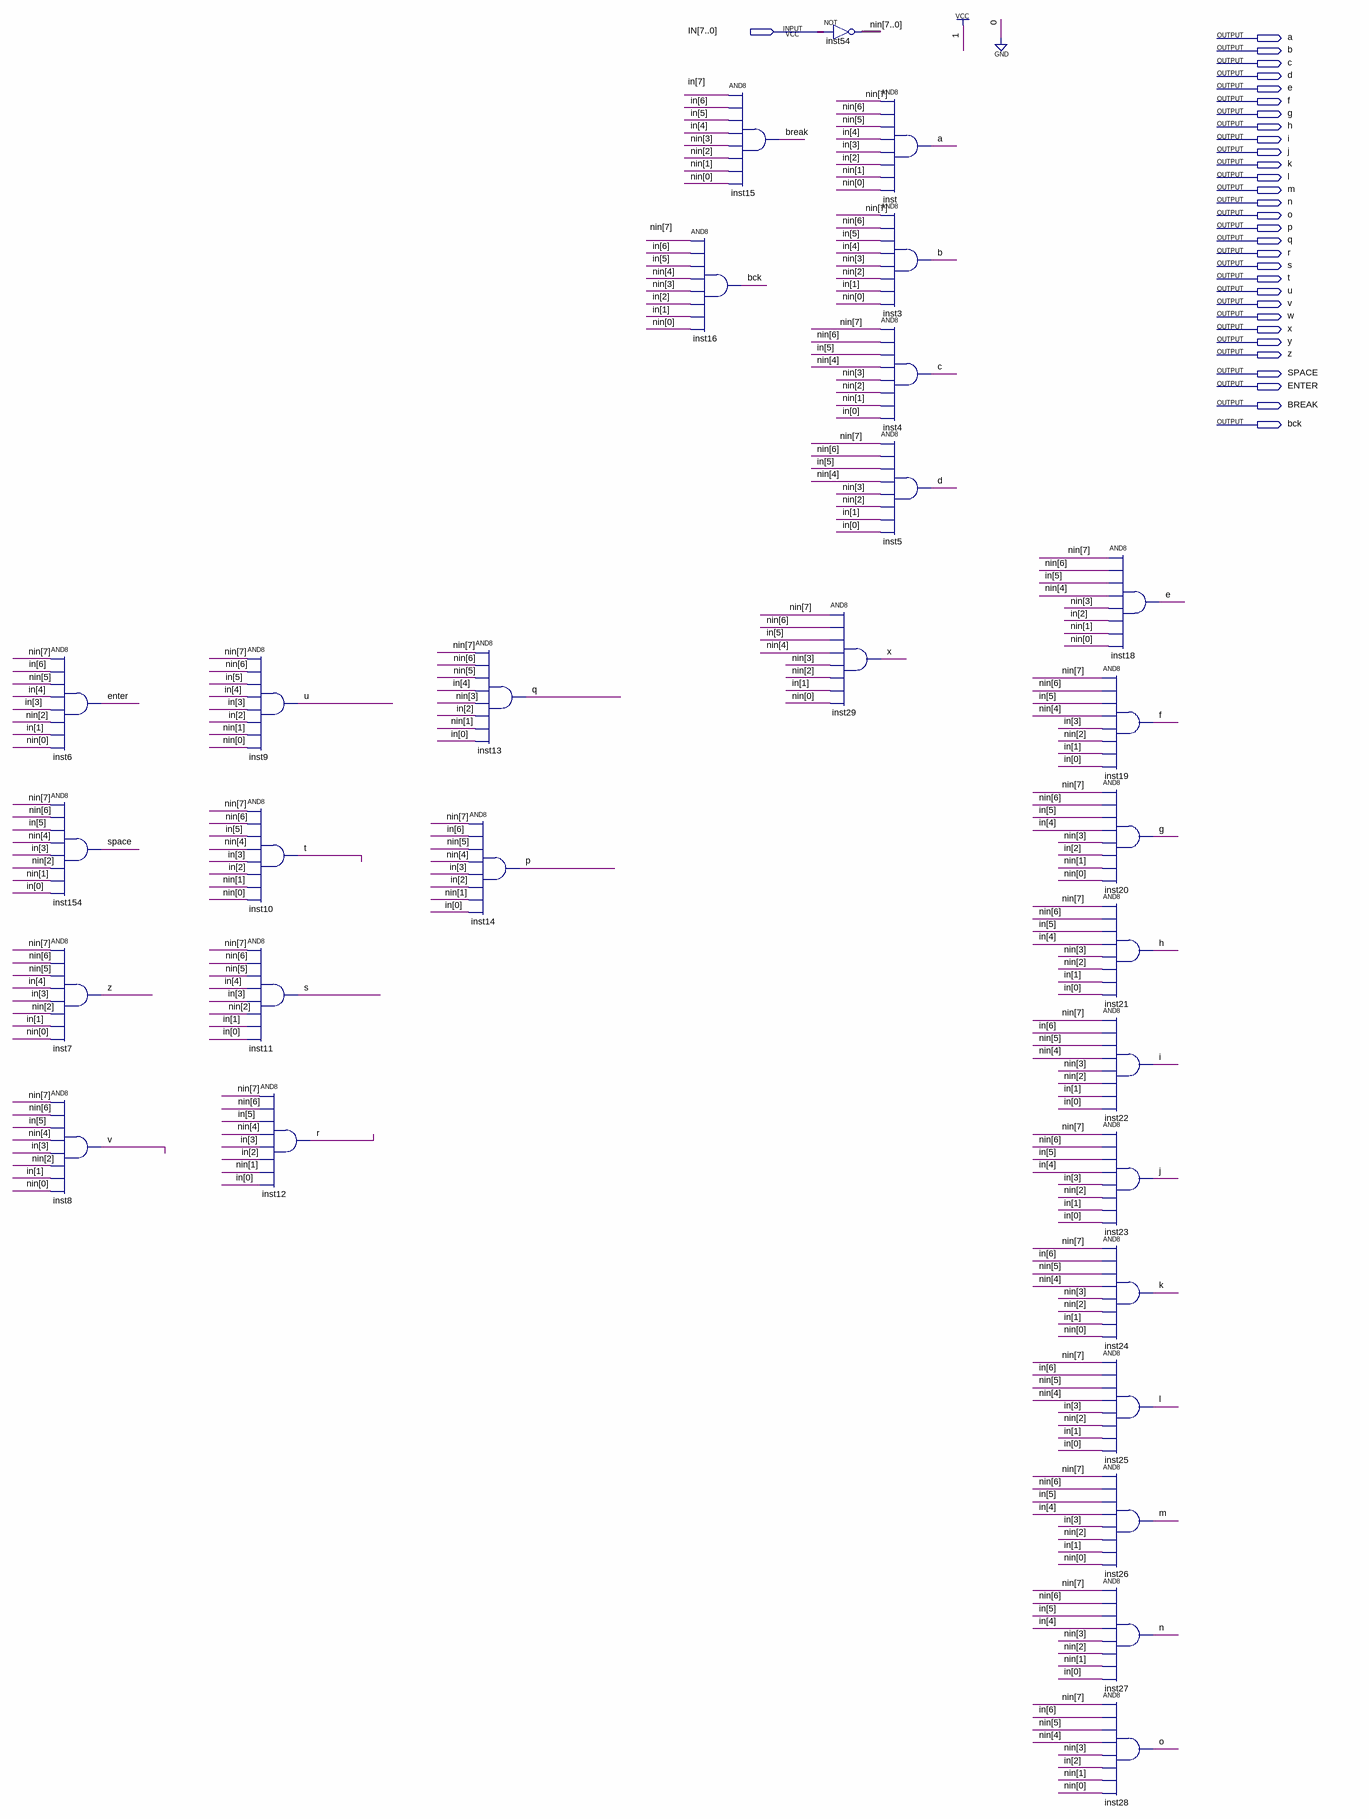
[diagram p0: schematic sheet]
// Quartus schematic Kodovi.bdf as structural Verilog: 29 symbols, 31 pins
module Kodovi (
  input  [7:0] IN,
  output a,
  output b,
  output c,
  output d,
  output e,
  output f,
  output g,
  output h,
  output i,
  output j,
  output k,
  output l,
  output m,
  output n,
  output o,
  output p,
  output q,
  output r,
  output s,
  output t,
  output u,
  output v,
  output w,
  output x,
  output y,
  output z,
  output SPACE,
  output ENTER,
  output BREAK,
  output bck
);

  wire [7:0] nin;

  and inst6 (ENTER, nin[7], IN[6], nin[5], IN[4], IN[3], nin[2], IN[1], nin[0]);
  and inst154 (SPACE, nin[7], nin[6], IN[5], nin[4], IN[3], nin[2], nin[1], IN[0]);
  and inst7 (z, nin[7], nin[6], nin[5], IN[4], IN[3], nin[2], IN[1], nin[0]);
  and inst8 (v, nin[7], nin[6], IN[5], nin[4], IN[3], nin[2], IN[1], nin[0]);
  and inst9 (u, nin[7], nin[6], IN[5], IN[4], IN[3], IN[2], nin[1], nin[0]);
  and inst10 (t, nin[7], nin[6], IN[5], nin[4], IN[3], IN[2], nin[1], nin[0]);
  and inst11 (s, nin[7], nin[6], nin[5], IN[4], IN[3], nin[2], IN[1], IN[0]);
  and inst12 (r, nin[7], nin[6], IN[5], nin[4], IN[3], IN[2], nin[1], IN[0]);
  and inst13 (q, nin[7], nin[6], nin[5], IN[4], nin[3], IN[2], nin[1], IN[0]);
  and inst14 (p, nin[7], IN[6], nin[5], nin[4], IN[3], IN[2], nin[1], IN[0]);
  and inst16 (bck, nin[7], IN[6], IN[5], nin[4], nin[3], IN[2], IN[1], nin[0]);
  and inst15 (BREAK, IN[7], IN[6], IN[5], IN[4], nin[3], nin[2], nin[1], nin[0]);
  assign nin = ~IN;  // NOT inst54, 8 bits wide
  and inst29 (x, nin[7], nin[6], IN[5], nin[4], nin[3], nin[2], IN[1], nin[0]);
  and inst (a, nin[7], nin[6], nin[5], IN[4], IN[3], IN[2], nin[1], nin[0]);
  and inst3 (b, nin[7], nin[6], IN[5], IN[4], nin[3], nin[2], IN[1], nin[0]);
  and inst4 (c, nin[7], nin[6], IN[5], nin[4], nin[3], nin[2], nin[1], IN[0]);
  and inst5 (d, nin[7], nin[6], IN[5], nin[4], nin[3], nin[2], IN[1], IN[0]);
  and inst19 (f, nin[7], nin[6], IN[5], nin[4], IN[3], nin[2], IN[1], IN[0]);
  and inst20 (g, nin[7], nin[6], IN[5], IN[4], nin[3], IN[2], nin[1], nin[0]);
  and inst21 (h, nin[7], nin[6], IN[5], IN[4], nin[3], nin[2], IN[1], IN[0]);
  and inst22 (i, nin[7], IN[6], nin[5], nin[4], nin[3], nin[2], IN[1], IN[0]);
  and inst23 (j, nin[7], nin[6], IN[5], IN[4], IN[3], nin[2], IN[1], IN[0]);
  and inst24 (k, nin[7], IN[6], nin[5], nin[4], nin[3], nin[2], IN[1], nin[0]);
  and inst25 (l, nin[7], IN[6], nin[5], nin[4], IN[3], nin[2], IN[1], IN[0]);
  and inst26 (m, nin[7], nin[6], IN[5], IN[4], IN[3], nin[2], IN[1], nin[0]);
  and inst27 (n, nin[7], nin[6], IN[5], IN[4], nin[3], nin[2], nin[1], IN[0]);
  and inst28 (o, nin[7], IN[6], nin[5], nin[4], nin[3], IN[2], nin[1], nin[0]);
  and inst18 (e, nin[7], nin[6], IN[5], nin[4], nin[3], IN[2], nin[1], nin[0]);
endmodule
